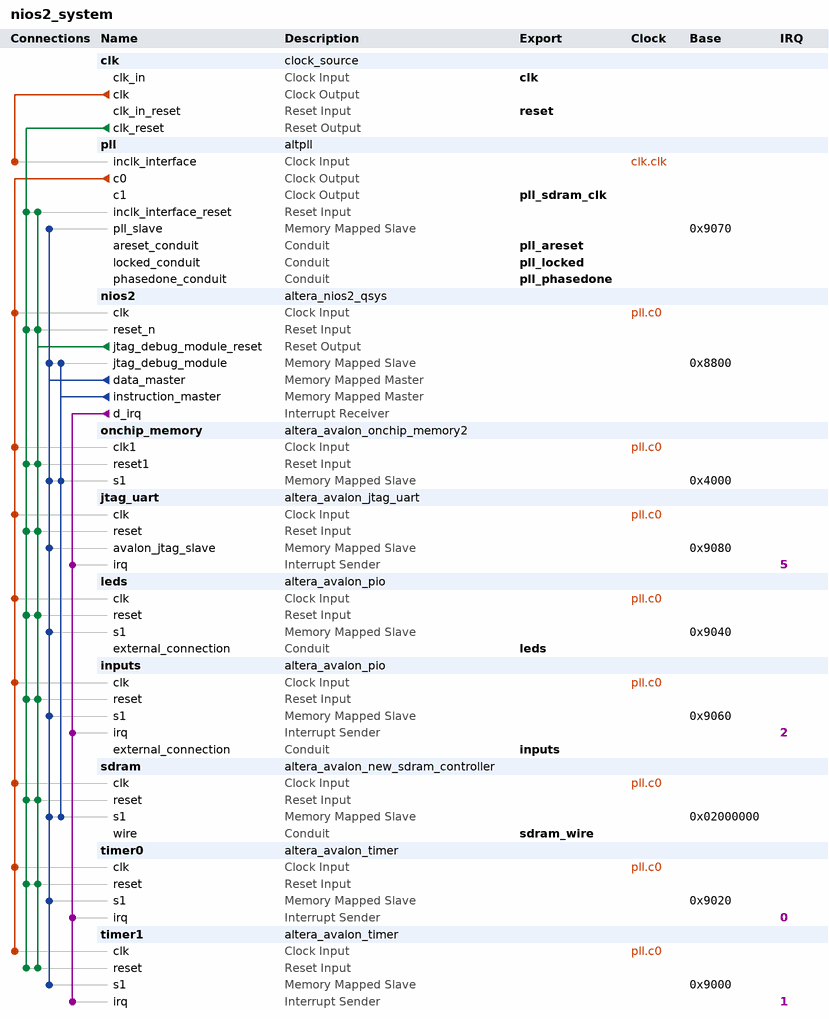
[diagram p0: system contents]
# Platform Designer (Qsys) system nios2_system, Cyclone IV E EP4CE22F17C6
# Parameters at their usual value, and those the tool derives, are not listed.
package require -exact qsys 14.1
create_system nios2_system
set_project_property DEVICE_FAMILY {Cyclone IV E}
set_project_property DEVICE EP4CE22F17C6

add_instance clk clock_source 14.1
set_instance_parameter_value clk clockFrequency 50000000

add_instance pll altpll 14.1
set_instance_parameter_value pll CLK0_DIVIDE_BY 1
set_instance_parameter_value pll CLK0_MULTIPLY_BY 1
set_instance_parameter_value pll CLK1_DIVIDE_BY 1
set_instance_parameter_value pll CLK1_DUTY_CYCLE 50
set_instance_parameter_value pll CLK1_MULTIPLY_BY 1
set_instance_parameter_value pll CLK1_PHASE_SHIFT -3000
set_instance_parameter_value pll INCLK0_INPUT_FREQUENCY 20000
set_instance_parameter_value pll PORT_ARESET PORT_USED
set_instance_parameter_value pll PORT_LOCKED PORT_USED
set_instance_parameter_value pll PORT_clk1 PORT_USED
set_instance_parameter_value pll PORT_clk2 PORT_UNUSED
set_instance_parameter_value pll PORT_clk3 PORT_UNUSED

add_instance nios2 altera_nios2_qsys 14.1
set_instance_parameter_value nios2 breakSlave nios2.jtag_debug_module
set_instance_parameter_value nios2 exceptionSlave onchip_memory.s1
set_instance_parameter_value nios2 icache_size 4096
set_instance_parameter_value nios2 impl Tiny
set_instance_parameter_value nios2 mmu_TLBMissExcSlave None
set_instance_parameter_value nios2 resetSlave onchip_memory.s1
set_instance_parameter_value nios2 resetrequest_enabled true

add_instance onchip_memory altera_avalon_onchip_memory2 14.1
set_instance_parameter_value onchip_memory dataWidth 32
set_instance_parameter_value onchip_memory dualPort false
set_instance_parameter_value onchip_memory initMemContent true
set_instance_parameter_value onchip_memory initializationFileName onchip_mem.hex
set_instance_parameter_value onchip_memory memorySize 16384

add_instance jtag_uart altera_avalon_jtag_uart 14.1
set_instance_parameter_value jtag_uart simInteractiveOptions NO_INTERACTIVE_WINDOWS

add_instance leds altera_avalon_pio 14.1
set_instance_parameter_value leds bitModifyingOutReg true
set_instance_parameter_value leds direction Output
set_instance_parameter_value leds width 8

add_instance inputs altera_avalon_pio 14.1
set_instance_parameter_value inputs bitClearingEdgeCapReg true
set_instance_parameter_value inputs captureEdge true
set_instance_parameter_value inputs direction Input
set_instance_parameter_value inputs edgeType FALLING
set_instance_parameter_value inputs generateIRQ true
set_instance_parameter_value inputs irqType EDGE
set_instance_parameter_value inputs simDoTestBenchWiring true
set_instance_parameter_value inputs width 8

add_instance sdram altera_avalon_new_sdram_controller 14.1
set_instance_parameter_value sdram TAC 5.5
set_instance_parameter_value sdram TRCD 20.0
set_instance_parameter_value sdram TRP 20.0
set_instance_parameter_value sdram casLatency 3
set_instance_parameter_value sdram columnWidth 9
set_instance_parameter_value sdram dataWidth 16
set_instance_parameter_value sdram generateSimulationModel false
set_instance_parameter_value sdram model single_Micron_MT48LC4M32B2_7_chip
set_instance_parameter_value sdram numberOfBanks 4
set_instance_parameter_value sdram numberOfChipSelects 1
set_instance_parameter_value sdram powerUpDelay 100.0
set_instance_parameter_value sdram refreshPeriod 15.625
set_instance_parameter_value sdram rowWidth 13

add_instance timer0 altera_avalon_timer 14.1
set_instance_parameter_value timer0 period 5
set_instance_parameter_value timer0 periodUnits SEC

add_instance timer1 altera_avalon_timer 14.1
set_instance_parameter_value timer1 period 5
set_instance_parameter_value timer1 periodUnits SEC

# connections
add_connection clk.clk pll.inclk_interface clock
add_connection pll.c0 inputs.clk clock
add_connection pll.c0 jtag_uart.clk clock
add_connection pll.c0 leds.clk clock
add_connection pll.c0 nios2.clk clock
add_connection pll.c0 onchip_memory.clk1 clock
add_connection pll.c0 sdram.clk clock
add_connection pll.c0 timer0.clk clock
add_connection pll.c0 timer1.clk clock
add_connection clk.clk_reset inputs.reset reset
add_connection clk.clk_reset jtag_uart.reset reset
add_connection clk.clk_reset leds.reset reset
add_connection clk.clk_reset nios2.reset_n reset
add_connection clk.clk_reset onchip_memory.reset1 reset
add_connection clk.clk_reset pll.inclk_interface_reset reset
add_connection clk.clk_reset sdram.reset reset
add_connection clk.clk_reset timer0.reset reset
add_connection clk.clk_reset timer1.reset reset
add_connection nios2.jtag_debug_module_reset inputs.reset reset
add_connection nios2.jtag_debug_module_reset jtag_uart.reset reset
add_connection nios2.jtag_debug_module_reset leds.reset reset
add_connection nios2.jtag_debug_module_reset nios2.reset_n reset
add_connection nios2.jtag_debug_module_reset onchip_memory.reset1 reset
add_connection nios2.jtag_debug_module_reset pll.inclk_interface_reset reset
add_connection nios2.jtag_debug_module_reset sdram.reset reset
add_connection nios2.jtag_debug_module_reset timer0.reset reset
add_connection nios2.jtag_debug_module_reset timer1.reset reset
add_connection nios2.data_master inputs.s1 avalon
set_connection_parameter_value nios2.data_master/inputs.s1 baseAddress 0x9060
add_connection nios2.data_master jtag_uart.avalon_jtag_slave avalon
set_connection_parameter_value nios2.data_master/jtag_uart.avalon_jtag_slave baseAddress 0x9080
add_connection nios2.data_master leds.s1 avalon
set_connection_parameter_value nios2.data_master/leds.s1 baseAddress 0x9040
add_connection nios2.data_master nios2.jtag_debug_module avalon
set_connection_parameter_value nios2.data_master/nios2.jtag_debug_module baseAddress 0x8800
add_connection nios2.data_master onchip_memory.s1 avalon
set_connection_parameter_value nios2.data_master/onchip_memory.s1 baseAddress 0x4000
add_connection nios2.data_master pll.pll_slave avalon
set_connection_parameter_value nios2.data_master/pll.pll_slave baseAddress 0x9070
add_connection nios2.data_master sdram.s1 avalon
set_connection_parameter_value nios2.data_master/sdram.s1 baseAddress 0x02000000
add_connection nios2.data_master timer0.s1 avalon
set_connection_parameter_value nios2.data_master/timer0.s1 baseAddress 0x9020
add_connection nios2.data_master timer1.s1 avalon
set_connection_parameter_value nios2.data_master/timer1.s1 baseAddress 0x9000
add_connection nios2.instruction_master nios2.jtag_debug_module avalon
set_connection_parameter_value nios2.instruction_master/nios2.jtag_debug_module baseAddress 0x8800
add_connection nios2.instruction_master onchip_memory.s1 avalon
set_connection_parameter_value nios2.instruction_master/onchip_memory.s1 baseAddress 0x4000
add_connection nios2.instruction_master sdram.s1 avalon
set_connection_parameter_value nios2.instruction_master/sdram.s1 baseAddress 0x02000000
add_connection nios2.d_irq inputs.irq interrupt
set_connection_parameter_value nios2.d_irq/inputs.irq irqNumber 2
add_connection nios2.d_irq jtag_uart.irq interrupt
set_connection_parameter_value nios2.d_irq/jtag_uart.irq irqNumber 5
add_connection nios2.d_irq timer0.irq interrupt
set_connection_parameter_value nios2.d_irq/timer0.irq irqNumber 0
add_connection nios2.d_irq timer1.irq interrupt
set_connection_parameter_value nios2.d_irq/timer1.irq irqNumber 1

# exported interfaces
add_interface clk clock sink
set_interface_property clk EXPORT_OF clk.clk_in
add_interface inputs conduit end
set_interface_property inputs EXPORT_OF inputs.external_connection
add_interface leds conduit end
set_interface_property leds EXPORT_OF leds.external_connection
add_interface pll_areset conduit end
set_interface_property pll_areset EXPORT_OF pll.areset_conduit
add_interface pll_locked conduit end
set_interface_property pll_locked EXPORT_OF pll.locked_conduit
add_interface pll_phasedone conduit end
set_interface_property pll_phasedone EXPORT_OF pll.phasedone_conduit
add_interface pll_sdram_clk clock source
set_interface_property pll_sdram_clk EXPORT_OF pll.c1
add_interface reset reset sink
set_interface_property reset EXPORT_OF clk.clk_in_reset
add_interface sdram_wire conduit end
set_interface_property sdram_wire EXPORT_OF sdram.wire

set_interconnect_requirement {$system} qsys_mm.clockCrossingAdapter HANDSHAKE
set_interconnect_requirement {$system} qsys_mm.insertDefaultSlave FALSE
set_interconnect_requirement {$system} qsys_mm.maxAdditionalLatency 1

save_system nios2_system.qsys
